# EAGLE design ENC (EAGLE 7.2.0)
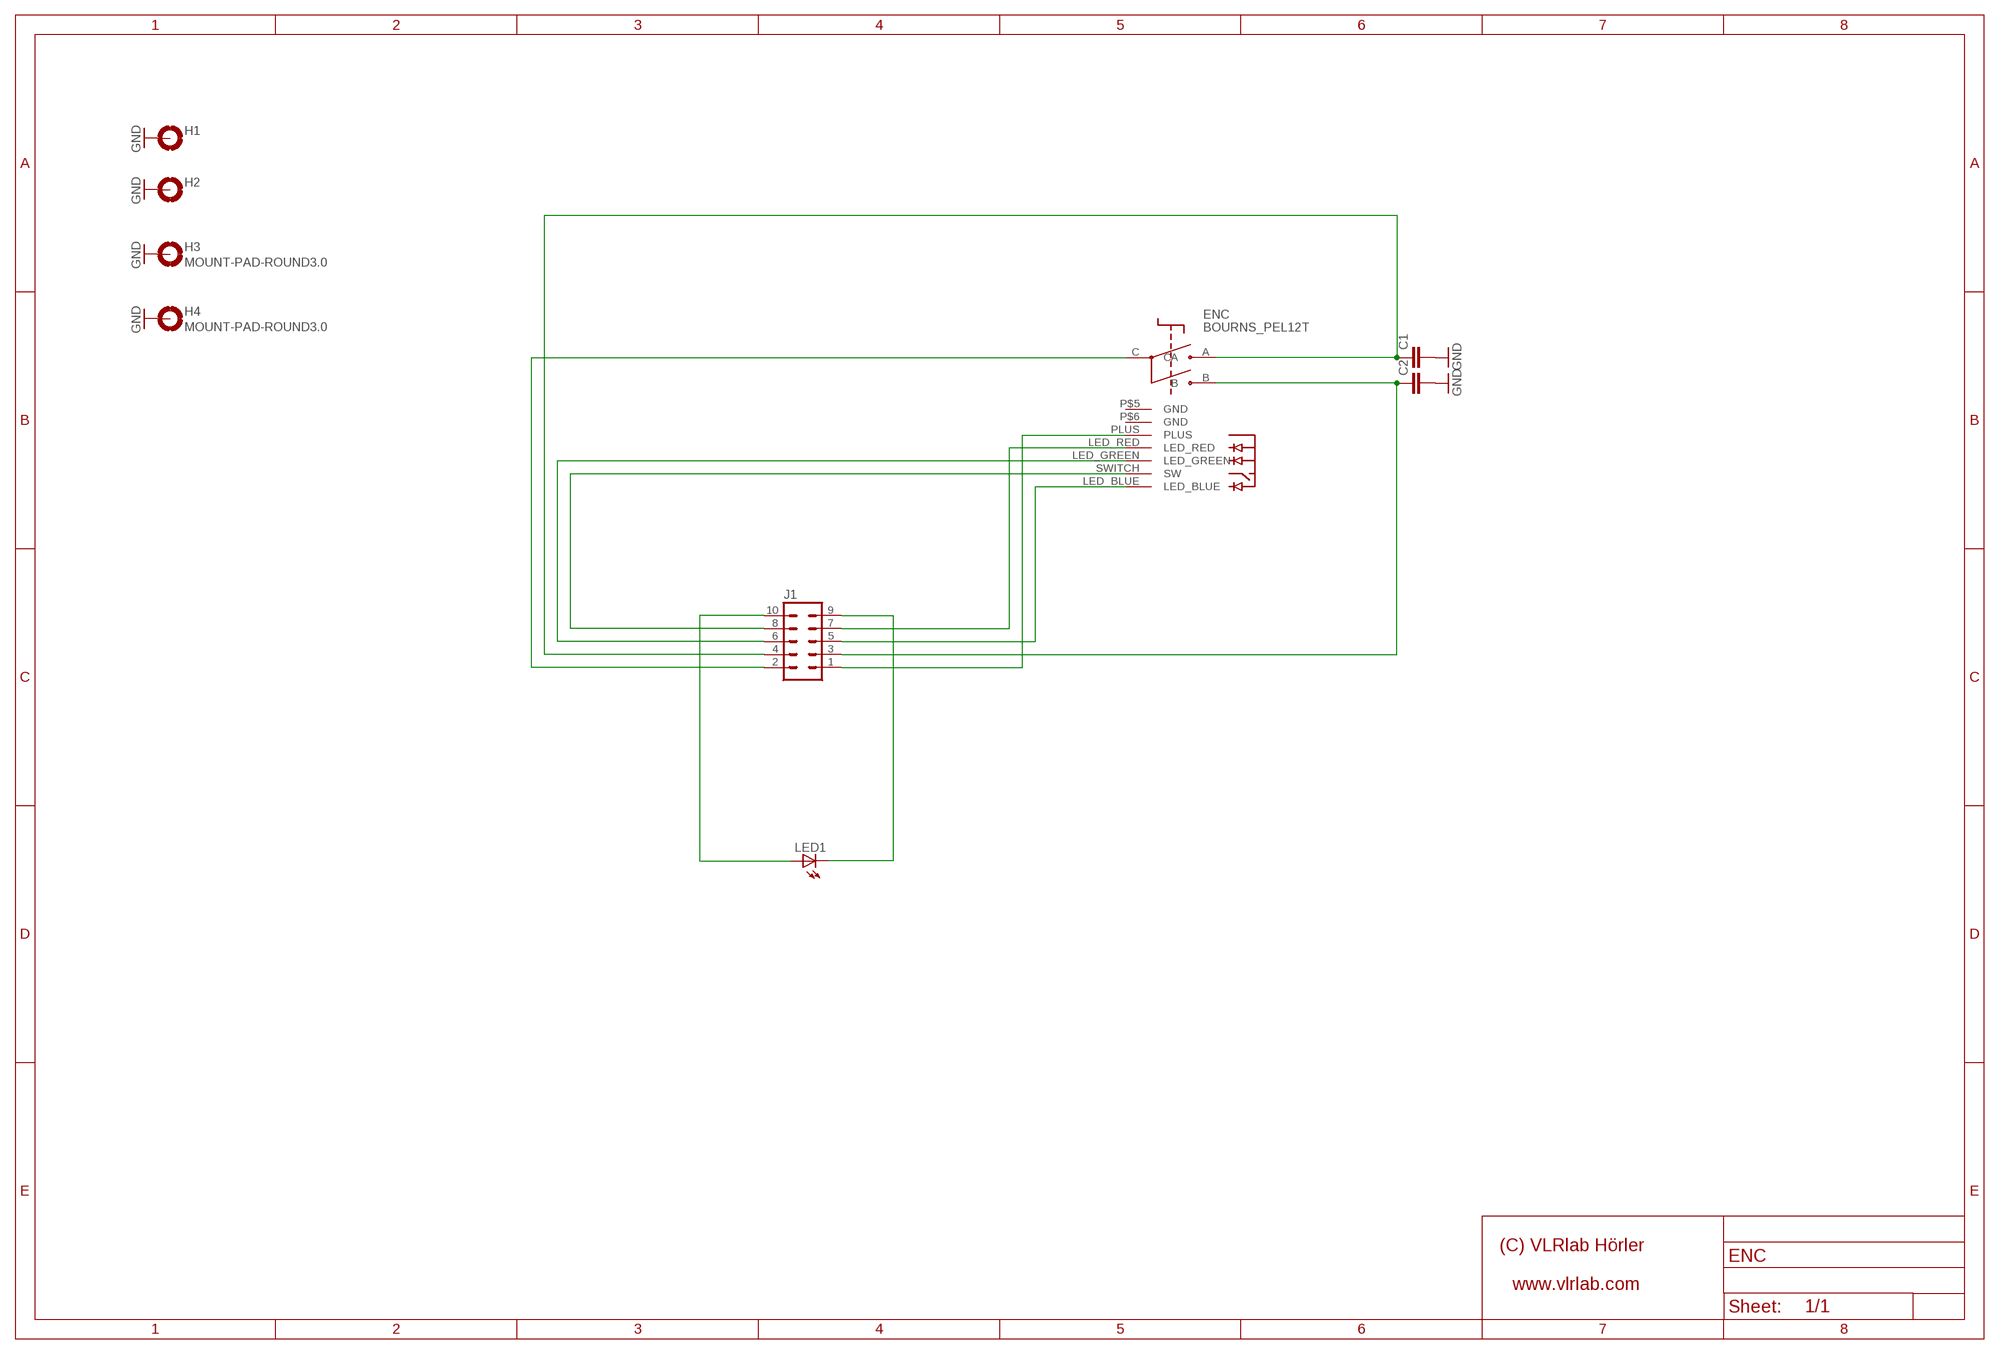
[diagram p0: schematic, sheet 1]

## Parts
C1  C-EU025-025X050  [C025-025X050]
C2  C-EU025-025X050  [C025-025X050]
ENC  BOURNS_PEL12T  [PEL12T]
H1  MOUNT-PAD-ROUND3.0  [3,0-PAD]
H2  MOUNT-PAD-ROUND3.0  [3,0-PAD]
H3  MOUNT-PAD-ROUND3.0  [3,0-PAD]
H4  MOUNT-PAD-ROUND3.0  [3,0-PAD]
J1  ML10ML10_TEXTFRONT  [ML10_TEXTFRONT]
LED1  LED3MM  [LED3MM]

## Nets
GND: C1.2 C2.2 H1.B3,0(MOUNT) H2.B3,0(MOUNT) H3.B3,0(MOUNT) H4.B3,0(MOUNT)
N$1: ENC.PLUS J1.1
N$2: ENC.C J1.2
N$3: C2.1 ENC.B J1.3
N$4: C1.1 ENC.A J1.4
N$5: ENC.LED_BLUE J1.5
N$6: ENC.LED_GREEN J1.6
N$7: ENC.LED_RED J1.7
N$8: ENC.SWITCH(SW) J1.8
N$9: J1.9 LED1.K(C)
N$10: J1.10 LED1.A
Unconnected: ENC.P$5(GND) ENC.P$6(GND)

## Library data of the parts
C1 C2 = rcl:C-EU: CAPACITOR, European symbol
ENC = Bourns Encoder:BOURNS_PEL12T
H1-H4 = holes:MOUNT-PAD-ROUND: MOUNTING PAD, round
J1 = con-ml_Ivan:ML10: HARTING
LED1 = led:LED: LED OSRAM: - CHIPLED LG R971, LG N971, LY N971, LG Q971, LY Q971, LO R971, LY R971 LH N974, LH R974 LS Q976, LO Q976, LY Q976 LO Q996 - Hyper CHIPLED LW Q18S LB Q993, LB Q99A, LB R99A - SideLED LS A670, LO A670, LY A670, LG A670, LP A670 LB A673, LV A673, LT A673, LW A673 LH A674 LY A675 LS A676, LA A676, LO A676, LY A676, LW A676 LS A679, LY A679, LG A679 - Hyper Micro SIDELED® LS Y876, LA Y876, LO Y876, LY Y876 LT Y87S - SmartLED LW L88C, LW L88S LB L89C, LB L89S, LG L890 LS L89K, LO L89K, LY L89K LS L896, LA L896, LO L896, LY L896 - TOPLED LS T670, LO T670, LY T670, LG T670, LP T670 LSG T670, LSP T670, LSY T670, LOP T670, LYG T670 LG T671, LOG T671, LSG T671 LB T673, LV T673, LT T673, LW T673 LH T674 LS T676, LA T676, LO T676, LY T676, LB T676, LH T676, LSB T676, LW T676 LB T67C, LV T67C, LT T67C, LS T67K, LO T67K, LY T67K, LW E67C LS E67B, LA E67B, LO E67B, LY E67B, LB E67C, LV E67C, LT E67C LW T67C LS T679, LY T679, LG T679 LS T770, LO T770, LY T770, LG T770, LP T770 LB T773, LV T773, LT T773, LW T773 LH T774 LS E675, LA E675, LY E675, LS T675 LS T776, LA T776, LO T776, LY T776, LB T776 LHGB T686 LT T68C, LB T68C - Hyper Mini TOPLED® LB M676 - Mini TOPLED Santana® LG M470 LS M47K, LO M47K, LY M47K Source: http://www.osram.convergy.de LUXEON: - LUMILED® LXK2-PW12-R00, LXK2-PW12-S00, LXK2-PW14-U00, LXK2-PW14-V00 LXK2-PM12-R00, LXK2-PM12-S00, LXK2-PM14-U00 LXK2-PE12-Q00, LXK2-PE12-R00, LXK2-PE12-S00, LXK2-PE14-T00, LXK2-PE14-U00 LXK2-PB12-K00, LXK2-PB12-L00, LXK2-PB12-M00, LXK2-PB14-N00, LXK2-PB14-P00, LXK2-PB14-Q00 LXK2-PR12-L00, LXK2-PR12-M00, LXK2-PR14-Q00, LXK2-PR14-R00 LXK2-PD12-Q00, LXK2-PD12-R00, LXK2-PD12-S00 LXK2-PH12-R00, LXK2-PH12-S00 LXK2-PL12-P00, LXK2-PL12-Q00, LXK2-PL12-R00 Source: www.luxeon.com KINGBRIGHT: KA-3528ASYC Source: www.kingbright.com

## Net classes
0 default: width 0.254 mm, drill 0.33 mm, clearance 0.254 mm
1 VDD: width 0.813 mm, drill 0.33 mm, clearance 0.254 mm to class 0, clearance 0.254 mm
2 10V: width 1.016 mm, drill 0.33 mm, clearance 0.254 mm to class 0, clearance 0.254 mm to class 1, clearance 0.254 mm

## Board
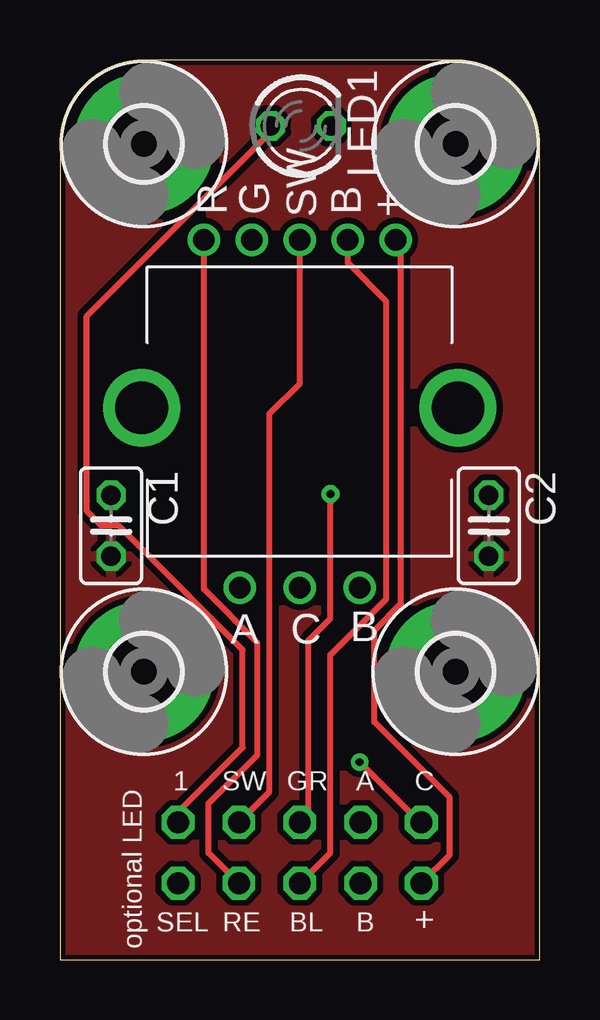
[diagram p1: board, top side]
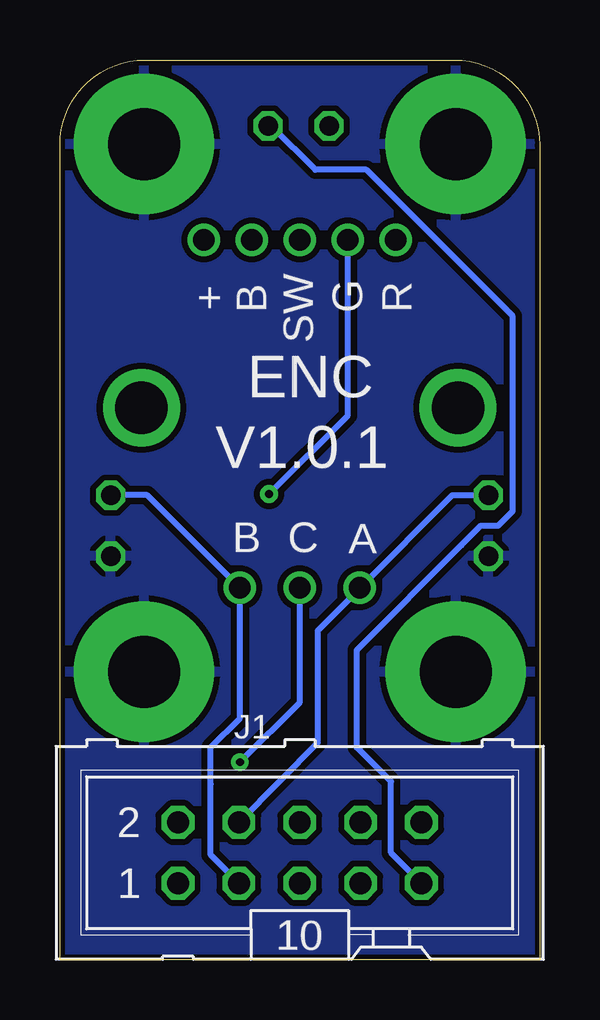
[diagram p2: board, bottom side, seen from below]

Size 20 x 37.5 mm. Coordinates in mm from the lower left corner, seen from the top.
Outline: 0,0 20,0 20,33.94 arc90 16.44,37.5 3.56,37.5 arc90 0,33.94 0,0
Copper layers (1*16): Top 0.07mm / dielectric 1.86mm / Bottom 0.07mm
Design rules "001_MakePCB-8mil_min *": minimum track width 8mil, minimum drill 13mil, track to track 8mil, track to pad 8mil, pad to pad 8mil, via to via 8mil, smd to smd 8mil, copper to edge 8mil, drill to drill 8mil, minimum pad ring 8mil, minimum via ring 8mil, stop-mask expansion 4mil, vias tented up to drill 14mil, thermal gap 10mil

### Footprints (pad centres in the part's own frame; a part is rotated, then mirrored left to right if it is on the bottom)
C025-025X050 = drill 0.813 octagon: 1 -1.27,0; 2 1.27,0
PEL12T = drill 0.9: A -2.5,-7.5; B 2.5,-7.5; C 0,-7.5; LED_BLUE 2,7; LED_GREEN -2,7; LED_RED -4,7; PLUS 4,7; SWITCH 0,7 | drill 2.2: P$5 6.6,0; P$6 -6.6,0
3,0-PAD = drill 3 pad 5.842: B3,0 0,0
ML10_TEXTFRONT = drill 0.914 octagon: 1 -5.08,-1.27; 2 -5.08,1.27; 3 -2.54,-1.27; 4 -2.54,1.27; 5 0,-1.27; 6 0,1.27; 7 2.54,-1.27; 8 2.54,1.27; 9 5.08,-1.27; 10 5.08,1.27
LED3MM = drill 0.813 octagon: A -1.27,0; K 1.27,0

### Placement (x,y rotation side)
C1  2.13,18.08 270 top
C2  17.88,18.08 270 top
ENC  10,23 0 top
H1  16.5,34 0 top
H2  3.5,34 0 top
H3  16.5,12 0 top
H4  3.5,12 0 top
J1  10,4.45 0 bottom
LED1  10.05,34.75 0 top
U$1  [VLRLAB_SMAL]  19.39,17.74 90 top
U$2  [VLRLAB_SMAL]  18.89,17.79 90 bottom

### Tracks (layer width: path | path; a pad name or v marks a point on that pad's centre or on a via)
GND
  pour Top: -0.12,-0.12 -0.12,37.62 20.14,37.62 20.14,-0.12
  pour Bottom: -0.12,-0.12 -0.12,34.06 arc-90 3.44,37.62 16.58,37.62 arc-90 20.14,34.06 20.14,-0.12
N$1
  Top 0.254: J1.1 15.08,3.21 16.26,4.37 16.26,6.76 13.11,9.91 13.11,13.72 14.22,14.83 14.22,29.67 ENC.PLUS
N$2  (via drill 0.33)
  Top 0.254: J1.2 15.01,5.72 v12.5,8.23
  Bottom 0.254: v12.5,8.23 10,10.73 ENC.C
N$3
  Bottom 0.254: J1.3 13.72,4.36 13.72,7.32 13.72,8.84 12.5,10.05 ENC.B 16.36,19.36 C2.1
N$4
  Bottom 0.254: J1.4 12.5,5.76 9.25,9.04 9.25,13.72 7.5,15.46 ENC.A 3.65,19.36 C1.1
N$5
  Top 0.254: J1.5 11.28,4.46 11.28,12.7 13.61,15.04 13.61,27.43 12,29.05 ENC.LED_BLUE
N$6  (via drill 0.33)
  Top 0.254: J1.6 10.36,6.08 10.36,13.31 11.28,14.22 v11.28,19.41
  Bottom 0.254: v11.28,19.41 8,22.68 ENC.LED_GREEN
N$7
  Top 0.254: J1.7 6.2,4.44 6.2,6.5 8.23,8.53 8.23,13.21 6,15.44 ENC.LED_RED
N$8
  Top 0.254: J1.8 8.74,7 8.74,22.76 10,24.02 ENC.SWITCH
N$9
  Bottom 0.254: J1.9 6.2,4.46 6.2,7.42 7.62,8.84 7.62,12.9 3.25,17.27 2.44,18.09 1.73,18.09 1.12,18.69 1.12,19.1 1.12,26.82 7.21,32.92 9.35,32.92 11.18,34.75 LED1.K
N$10
  Top 0.254: J1.10 4.98,5.78 4.98,6.2 7.62,8.84 7.62,12.9 3.25,17.27 2.44,18.09 1.73,18.09 1.12,18.69 1.12,19.1 1.12,26.82 8.78,34.48 LED1.A

### Text on the board
tNames: R | G | SW | B | + | A | C | B | 1 | SW | GR | A | C | SEL | RE | BL | B | + | optional LED
bNames: V1.0.1 | A | C | B